# Altium schematic sheet Inp.SchDoc
size A4
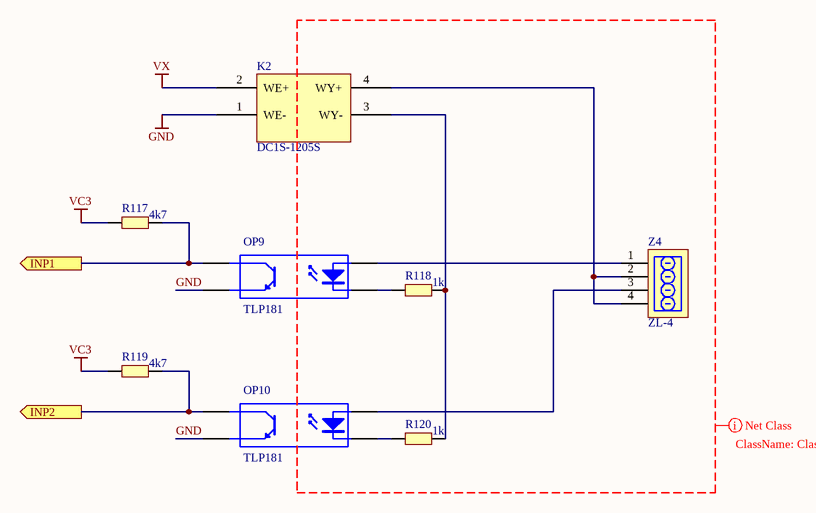
[diagram p0: Inp.SchDoc]

## Parts
K2  DC1S-1205S  [DCDC_SIL4]
OP9  TLP181  [TLP181_1]
OP10  TLP181  [TLP181_1]
R117  4k7  [0603R]
R118  1k  [0805R]
R119  4k7  [0603R]
R120  1k  [0805R]
Z4  ZL-4  [ARC-4-3.5-TYCO-1]

## Ports
INP1 (out), INP2 (out)

## Nets
GND: K2.1(WE-) OP9.3 OP10.3
VC3: R117.2 R119.2
VX: K2.2(WE+)
INP1: OP9.4 R117.1 ; port INP1
INP2: OP10.4 R119.1 ; port INP2
NetK2_3: K2.3(WY-) R118.1 R120.1
NetK2_4: K2.4(WY+) Z4.2 Z4.4
NetOP9_1: OP9.1 Z4.1
NetOP9_2: OP9.2 R118.2
NetOP10_1: OP10.1 Z4.3
NetOP10_2: OP10.2 R120.2

## Layout directives
net class Class_INP: (no net found under the mark)

## Library data of the parts
K2 = DCDC_AM1S
OP9 OP10 = TLP621: Optoisolator
R117-R120 = RES3